# Altium schematic sheet [2] Implausibilities.SchDoc
size A4
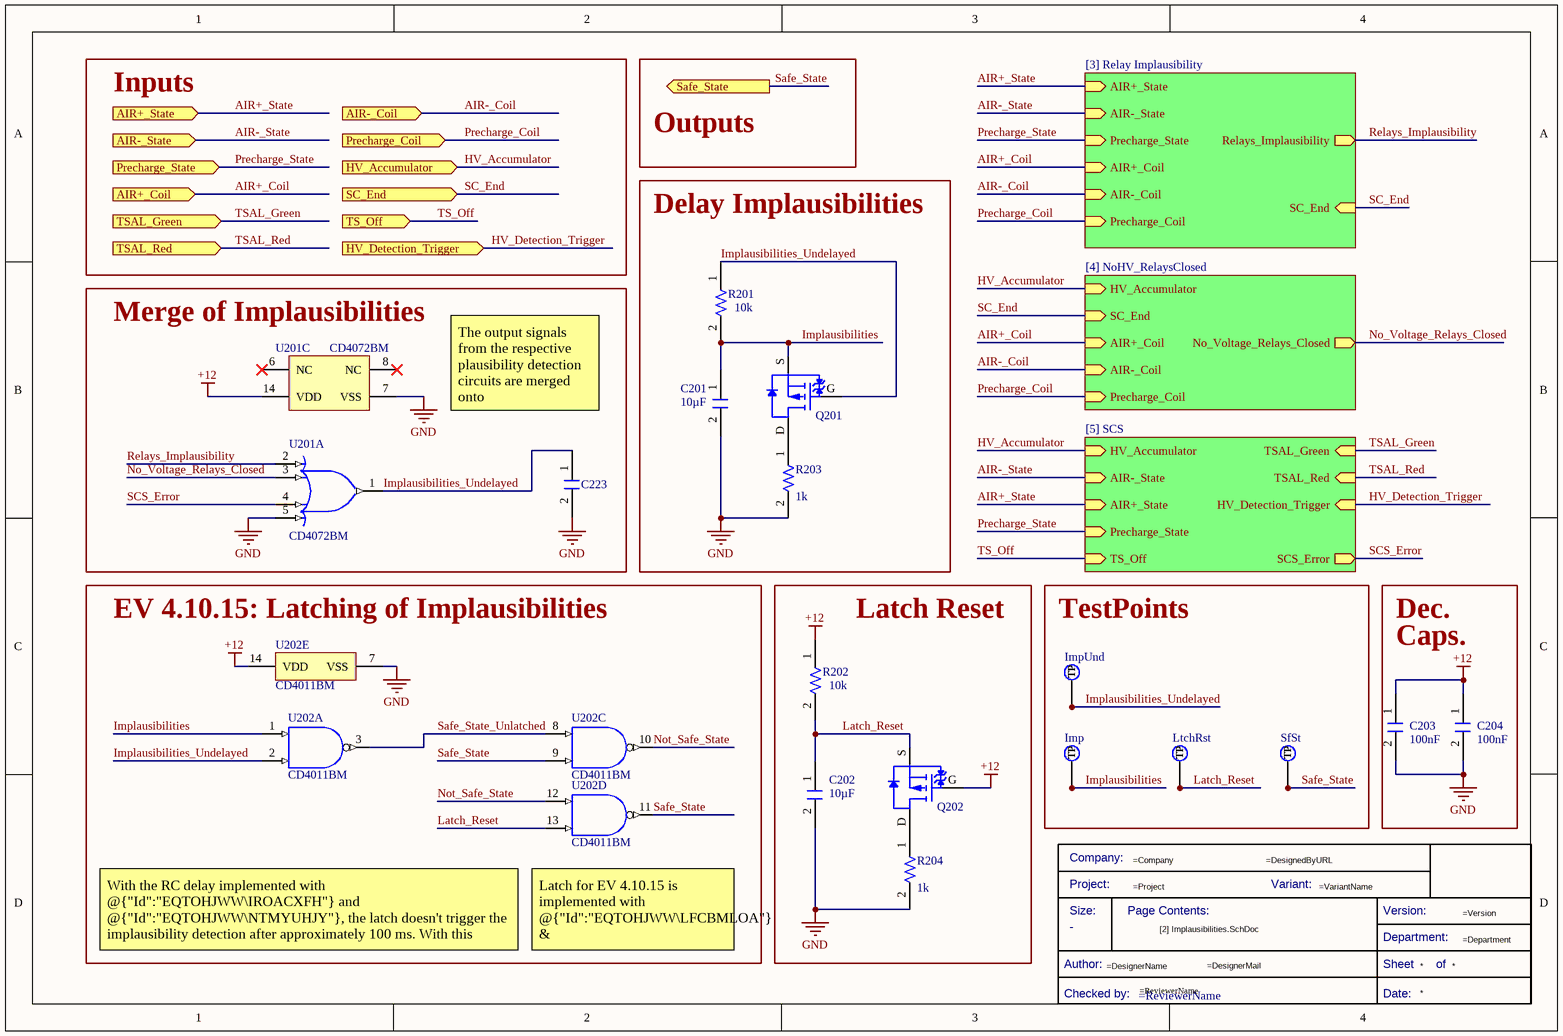
[diagram p0: [2] Implausibilities.SchDoc]

## Parts
*  Title Block_template  (value not drawn)  (graphical)
C201  value 10µF  [C0805FNPC-R]  (hidden comment: C10u-16V-0805FNPC-X5R)
C202  value 10µF  [C0805FNPC-R]  (hidden comment: C10u-16V-0805FNPC-X5R)
C203  value 100nF  [C0805FNPC-R]  (hidden comment: C100n-50V-0805FNPC-X7R)
C204  value 100nF  [C0805FNPC-R]  (hidden comment: C100n-50V-0805FNPC-X7R)
C223  C15p-50V-0805FNPC-NP0  [C0805FNPC-R]  (value not drawn)
Imp  TestPoint  [TestPoint]  (value not drawn)  (no BOM)
ImpUnd  TestPoint  [TestPoint]  (value not drawn)  (no BOM)
LtchRst  TestPoint  [TestPoint]  (value not drawn)  (no BOM)
Q201  TRT-PCH-2/30-BSS  [TRT-PCH-2/30-BSS]  (value not drawn)
Q202  TRT-PCH-2/30-BSS  [TRT-PCH-2/30-BSS]  (value not drawn)
R201  value 10k  [R0805FTK]  (hidden comment: R10k-0805FTK)
R202  value 10k  [R0805FTK]  (hidden comment: R10k-0805FTK)
R203  value 1k  [0805]  (hidden comment: R1K-0805-0.5W)
R204  value 1k  [0805]  (hidden comment: R1K-0805-0.5W)
SfSt  TestPoint  [TestPoint]  (value not drawn)  (no BOM)
U201  CD4072BM  [D0014A_N]  (parts A,C of 3)
U202  CD4011BM  [D0014A_N]  (parts A,C,D,E of 5)

## Blocks framed on the sheet
Delay Implausibilities: C201 Q201 R201 R203
Merge of Implausibilities: C223 U201
EV 4.10.15: Latching of Implausibilities: U202
Latch Reset: C202 Q202 R202 R204
TestPoints: Imp ImpUnd LtchRst SfSt

## Sub-sheets
EV 4.10.14 = [4] NoHV_RelaysClosed: HV_Accumulator (in), SC_End (in), AIR+_Coil (in), AIR-_Coil (in), Precharge_Coil (in), No_Voltage_Relays_Closed (out)
Relay Implausibility = [3] Relay Implausibility: AIR+_State (in), Precharge_State (in), AIR+_Coil (in), AIR-_Coil (in), Precharge_Coil (in), Relays_Implausibility (out), SC_End (in), AIR-_State (in)
SCS = [5] SCS: HV_Accumulator (in), AIR-_State (in), Precharge_State (in), SCS_Error (out), AIR+_State (in), TSAL_Green (in), TSAL_Red (in), TS_Off (in), HV_Detection_Trigger (in)

## Ports
AIR+_Coil (in, see [1] TSAL_Green[1C], [1] TSAL_Green[2A], [3] Relay Implausibility[1A], [4] NoHV_RelaysClosed[1A]), AIR+_State (in, see [1] TSAL_Green[1C], [1] TSAL_Green[2A], [3] Relay Implausibility[1A], [5] SCS[1A]), AIR-_Coil (in, see [1] TSAL_Green[1C], [1] TSAL_Green[2A], [3] Relay Implausibility[1A], [4] NoHV_RelaysClosed[1A]), AIR-_State (in, see [1] TSAL_Green[1C], [1] TSAL_Green[2A], [3] Relay Implausibility[1A], [5] SCS[1A]), HV_Accumulator (in, see [1] TSAL_Green[1C], [1] TSAL_Green[2B], [4] NoHV_RelaysClosed[1A], [5] SCS[1A]), HV_Detection_Trigger (in, see [1] TSAL_Green[1C], [1] TSAL_Green[2B], [5] SCS[1A], [7] TSAL_Red[2A]), Precharge_Coil (in, see [1] TSAL_Green[1C], [1] TSAL_Green[2B], [3] Relay Implausibility[1A], [4] NoHV_RelaysClosed[1A]), Precharge_State (in, see [1] TSAL_Green[1C], [1] TSAL_Green[2A], [3] Relay Implausibility[1A], [5] SCS[1A]), Safe_State (out, see [1] TSAL_Green[2C]), SC_End (in, see [1] TSAL_Green[1C], [1] TSAL_Green[2B], [3] Relay Implausibility[1B], [4] NoHV_RelaysClosed[1A]), TS_Off (in, see [1] TSAL_Green[1D], [1] TSAL_Green[4A], [5] SCS[1A], [6] Green_Driver[1A]), TSAL_Green (in, see [1] TSAL_Green[1D], [1] TSAL_Green[4A], [5] SCS[1A], [6] Green_Driver[2A]), TSAL_Red (in, see [1] TSAL_Green[1D], [1] TSAL_Green[3A], [5] SCS[1B], [7] TSAL_Red[2A], [8] Red_Driver[2A])

## Nets
+12: C203.1 C204.1 Q202.G R202.1 U201.14(VDD) U202.14(VDD)
GND: C201.2 C202.2 C203.2 C204.2 C223.2 R203.2 R204.2 U201.5(D) U201.7(VSS) U202.7(VSS)
AIR+_Coil: port AIR+_Coil, sheet Relay Implausibility/AIR+_Coil, sheet EV 4.10.14/AIR+_Coil
AIR+_State: port AIR+_State, sheet Relay Implausibility/AIR+_State, sheet SCS/AIR+_State
AIR-_Coil: port AIR-_Coil, sheet Relay Implausibility/AIR-_Coil, sheet EV 4.10.14/AIR-_Coil
AIR-_State: port AIR-_State, sheet Relay Implausibility/AIR-_State, sheet SCS/AIR-_State
HV_Accumulator: port HV_Accumulator, sheet SCS/HV_Accumulator, sheet EV 4.10.14/HV_Accumulator
HV_Detection_Trigger: port HV_Detection_Trigger, sheet SCS/HV_Detection_Trigger
Implausibilities: C201.1 Imp.1(TP) Q201.S R201.2 U202.1(A)
Implausibilities_Undelayed: C223.1 ImpUnd.1(TP) Q201.G R201.1 U201.1(J) U202.2(B)
Latch_Reset: C202.1 LtchRst.1(TP) Q202.S R202.2 U202.13(H)
No_Voltage_Relays_Closed: U201.3(B) ; sheet EV 4.10.14/No_Voltage_Relays_Closed
Not_Safe_State: U202.10(L) U202.12(G)
Precharge_Coil: port Precharge_Coil, sheet Relay Implausibility/Precharge_Coil, sheet EV 4.10.14/Precharge_Coil
Precharge_State: port Precharge_State, sheet Relay Implausibility/Precharge_State, sheet SCS/Precharge_State
Relays_Implausibility: U201.2(A) ; sheet Relay Implausibility/Relays_Implausibility
Safe_State: SfSt.1(TP) U202.9(F) U202.11(M) ; port Safe_State
Safe_State_Unlatched: U202.3(J) U202.8(E)
SC_End: port SC_End, sheet Relay Implausibility/SC_End, sheet EV 4.10.14/SC_End
SCS_Error: U201.4(C) ; sheet SCS/SCS_Error
TS_Off: port TS_Off, sheet SCS/TS_Off
TSAL_Green: port TSAL_Green, sheet SCS/TSAL_Green
TSAL_Red: port TSAL_Red, sheet SCS/TSAL_Red
NetQ201_D: Q201.D R203.1
NetQ202_D: Q202.D R204.1

Not connected (* = marked no-connect by the designer): U201 6(NC)* 8(NC)*

## Notes on the sheet
- Inputs
- Outputs
- The output signals from the respective plausibility detection circuits are merged onto @{"Id":"EQTOHJWW\DMHHQXNO"}.
- Dec.
- Caps.
- With the RC delay implemented with @{"Id":"EQTOHJWW\IROACXFH"} and @{"Id":"EQTOHJWW\NTMYUHJY"}, the latch doesn't trigger the implausibility detection after approximately 100 ms. With this system, possible faulty implausibility detections are avoided (e.g. AIRs activation delay).
- (near U202) Latch for EV 4.10.15 is implemented with @{"Id":"EQTOHJWW\LFCBMLOA"} & @{"Id":"EQTOHJWW\TXFEAGDM"}
- (in symbol CMP-00043-8) Company:; Project:; Variant:; Size:; Page Contents:; Version:; Department:; Author:; Sheet; of; Checked by:; Date:

## Library data of the parts
* = CMP-00043-8: Standard Title Block; .SCHcheck: GP; Checked by:: =ReviewerName; Size: -; Design Item ID: Title Block_template; .PCBcheck: GP; .Creator: GP; Source: e-Tech_Racing.SchLib; Category: Title Block
C201 C202 = CMP-00055-8: Multilayer Ceramic Capacitor, Wcap-Csgp Series, 10 F, 20%, X5R, 16 V, 0805 [2012 Metric] Rohs Compliant: Yes; Manufacturer Part Number 1: 885012107014; Manufacturer 1: Wurth Electronics; .Creator: DR; Voltage Rating: 16V; Pricing 1: 50=0,21000, 250=0,20200, 500=0,19100, 1000=0,17400, 2500=0,14700 (GBP); ComponentLink3URL: https://katalog.we-online.de/pbs/datasheet/885012107014.pdf?src-supplier=Digi-Key; Category: Ceramic Capacitors; Thickness: 0.057inch; ComponentLink4URL: http://www.farnell.com/datasheets/1958454.pdf?src-supplier=Newark; Width: 0.049inch; Source: Passives.SchLib; Design Item ID: C10u-16V-0805FNPC-X5R; Packaging: Cut Tape; ComponentLink3Description: https://katalog.we-online.de/pbs/datasheet/885012107014.pdf?src-supplier=Digi-Key; ComponentLink2URL: http://www.farnell.com/datasheets/1958454.pdf?src-supplier=Element14; RoHS: Yes; ComponentLink1Description: http://www.farnell.com/datasheets/1958454.pdf?src-supplier=Farnell; ComponentLink2Description: http://www.farnell.com/datasheets/1958454.pdf?src-supplier=Element14; Min Operating Temperature: -55°C; Case Code (Metric): 2012; Case/Package: 0805; Mount: Surface Mount; Tolerance: 20%; Length: 0.079inch; ComponentLink4Description: http://www.farnell.com/datasheets/1958454.pdf?src-supplier=Newark; ComponentLink1URL: http://www.farnell.com/datasheets/1958454.pdf?src-supplier=Farnell; Dielectric: X5R; RoHS Compliant: Yes; Voltage Rating (DC): 16V; Max Operating Temperature: 85°C; Stock 1: 81550; REACH SVHC: Unknown
C203 C204 = CMP-00063-3: Cap, 0.1ΜF, 50V, 10%, X7R, 0805; Manufacturer Part Number 1: 885012207098; Manufacturer 1: Wurth Electronics; .Creator: DR; ComponentLink2Description: http://www.farnell.com/datasheets/1958498.pdf?src-supplier=Element14; ComponentLink1Description: http://www.farnell.com/datasheets/1958498.pdf?src-supplier=Farnell; Thickness: 0.035inch; ComponentLink1URL: http://www.farnell.com/datasheets/1958498.pdf?src-supplier=Farnell; Min Operating Temperature: -55°C; Packaging: Cut Tape; ComponentLink2URL: http://www.farnell.com/datasheets/1958498.pdf?src-supplier=Element14; Mount: Surface Mount; Voltage Rating (DC): 50V; Tolerance: 10%; Category: Ceramic Capacitors; RoHS: Yes; Width: 0.049inch; Pricing 1: 100=0,10200, 500=0,07100, 2000=0,06100 (GBP); RoHS Compliant: Yes; ComponentLink4Description: http://www.farnell.com/datasheets/1958498.pdf?src-supplier=Newark; Dielectric: X7R; Stock 1: 8000; Length: 0.079inch; ComponentLink3URL: https://katalog.we-online.de/pbs/datasheet/885012207098.pdf?src-supplier=Digi-Key; ComponentLink3Description: https://katalog.we-online.de/pbs/datasheet/885012207098.pdf?src-supplier=Digi-Key; Design Item ID: C100n-50V-0805FNPC-X7R; ComponentLink4URL: http://www.farnell.com/datasheets/1958498.pdf?src-supplier=Newark; REACH SVHC: Unknown; Case Code (Metric): 2012; Voltage Rating: 50V; Max Operating Temperature: 125°C; Source: Passives.SchLib; Case/Package: 0805
C223 = CMP-00056-3: Cap, 15PF, 50V, 5%, C0G/NP0, 0805; Manufacturer Part Number 1: 885012007052; Manufacturer 1: Wurth Electronics; .Creator: DR; Thickness: 0.028inch; RoHS Compliant: Yes; ComponentLink2URL: http://katalog.we-online.de/pbs/datasheet/885012007052.pdf?src-supplier=Digi-Key; Design Item ID: C15p-50V-0805FNPC-NP0; Case Code (Metric): 2012; Max Operating Temperature: 125°C; Mount: Surface Mount; Category: Ceramic Capacitors; Min Operating Temperature: -55°C; Case/Package: 0805; ComponentLink3Description: https://katalog.we-online.de/pbs/datasheet/885012007052.pdf?src-supplier=Digi-Key; ComponentLink1Description: http://www.farnell.com/datasheets/2031702.pdf?src-supplier=Farnell; ComponentLink1URL: http://www.farnell.com/datasheets/2031702.pdf?src-supplier=Farnell; RoHS: Yes; Voltage Rating: 50V; Length: 0.079inch; Source: Passives.SchLib; Value: 15pF; Pricing 1: 1=0,10800, 10=0,05200, 25=0,05100, 50=0,04900, 100=0,04800, 250=0,04600, 500=0,04300 (USD); Tolerance: 5%; ComponentLink3URL: https://katalog.we-online.de/pbs/datasheet/885012007052.pdf?src-supplier=Digi-Key; Stock 1: 815; Packaging: Cut Tape; Width: 0.049inch; ComponentLink2Description: http://katalog.we-online.de/pbs/datasheet/885012007052.pdf?src-supplier=Digi-Key
Imp ImpUnd LtchRst SfSt = CMP-00042-2: Test Point 1x1 mm; .SCHcheck: GP; Category: TestPoint; Source: e-Tech_Racing.SchLib; .Creator: GP; .PCBcheck: GP; Design Item ID: TestPoint
Q201 Q202 = CMP-00144-2: Infineon’s highly innovative OptiMOS™ families include p-channel power MOSFETs, SOT-23-3, RoHS; Manufacturer Part Number: BSS308PEH6327; .Creator: DO; Drain to Source Voltage (Vdss): 30V; Rise Time: 7.7ns; Turn-On Delay Time: 5.6ns; Fall Time: 2.8ns; Input Capacitance: 500pF; Turn-Off Delay Time: 15.3ns; Rds On Max: 80mR; Threshold Voltage: -1.5V; Gate to Source Voltage (Vgs): 20V; Max Power Dissipation: 500mW; Continuous Drain Current (ID): 2A; Stock 1: 4000; ComponentLink1Description: datasheet; Series: OptiMOS™; Source: Semiconductor.SchLib; Number of Pins: 3; ComponentLink2Description: https://datasheet.ciiva.com/11171/infineon-bss308pe-ds-v02-03-en-11171385.pdf?src-supplier=Avnet; REACH SVHC: No SVHC; Mount: Surface Mount; Min Operating Temperature: -55°C; Package Quantity: 1; Design Item ID: TRT-PCH-2/30-BSS; Max Operating Temperature: 150°C; Packaging: Tape and Reel; RoHS: Yes; Category: MOSFETs; Pricing 1: 50=0,50300, 100=0,26400, 250=0,25900, 500=0,25200, 1000=0,24700 (USD); Case/Package: TO-236-3; ComponentLink1URL: https://datasheet.ciiva.com/6379/infineon-bss308pe-ds-v02-03-en-6379920.pdf?src-supplier=Digi-Key; ComponentLink2URL: https://datasheet.ciiva.com/11171/infineon-bss308pe-ds-v02-03-en-11171385.pdf?src-supplier=Avnet; Manufacturer: Infineon
R201 R202 = CMP-00085-4: BOURNS         CR0805-JW-103ELF            Surface Mount Chip Resistor, Thick Film, CR Series, 10 kohm, 125 mW,  5%, 150 V; .Creator: DR; Power Rating: 125mW; Voltage Rating (DC): 100V; Voltage Rating: 150V; Temperature Coefficient: 200ppm/°C; ComponentLink6URL: https://datasheet.ciiva.com/16783/70154685-16783482.pdf?src-supplier=Allied+Electronics; Manufacturer 1: Bourns; Package Quantity: 1; ComponentLink10URL: https://datasheet.ciiva.com/7985/1856384-7985869.pdf?src-supplier=Element14; Technology: THICK FILM; Source: Passives.SchLib; RoHS Compliant: Yes; ComponentLink10Description: https://datasheet.ciiva.com/7985/1856384-7985869.pdf?src-supplier=Element14; ComponentLink1URL: https://datasheet.ciiva.com/11821/0900766b80fcdb72-11821135.pdf?src-supplier=RSComponents; ComponentLink7Description: https://datasheet.ciiva.com/5548/chpreztr-5548491.pdf?src-supplier=Mouser; Radiation Hardening: No; Design Item ID: R10k-0805FTK; ComponentLink4Description: https://datasheet.ciiva.com/7986/691949-7986187.pdf?src-supplier=Element14; Pins: 2; ComponentLink9URL: https://datasheet.ciiva.com/6559/chpreztr-6559901.pdf?src-supplier=Digi-Key; Resistor Type: Thick Film; ComponentLink4URL: https://datasheet.ciiva.com/7986/691949-7986187.pdf?src-supplier=Element14; Contact Plating: Tin; Case Code (Metric): 2012; Military Standard: Not; Depth: 1.25mm; Case/Package: 0805; Packaging: Tape and Reel; ComponentLink9Description: https://datasheet.ciiva.com/6559/chpreztr-6559901.pdf?src-supplier=Digi-Key; Construction: Rectangular; Pricing 1: 1=0,05790, 10=0,01540, 25=0,01340, 100=0,00340 (USD); ComponentLink7URL: https://datasheet.ciiva.com/5548/chpreztr-5548491.pdf?src-supplier=Mouser; Category: Chip SMD Resistors; Length: 2mm; Max Operating Temperature: 155°C; Resistance Tolerance: 5%; Manufacturer Part Number 1: CR0805-JW-103ELF; Height: 0.5mm; ComponentLink2URL: https://datasheet.ciiva.com/9122/chpreztr-9122374.pdf?src-supplier=Avnet; Thickness: 508um; Max Power Dissipation: 125mW; ComponentLink8Description: https://datasheet.ciiva.com/6559/chpreztr-6559900.pdf?src-supplier=Digi-Key; REACH SVHC: No SVHC; ComponentLink8URL: https://datasheet.ciiva.com/6559/chpreztr-6559900.pdf?src-supplier=Digi-Key; ComponentLink5URL: https://datasheet.ciiva.com/30065/159chpreztr-30065976.pdf?src-supplier=Onlinecomponents.com; Width: 1.25mm; ComponentLink11URL: https://datasheet.ciiva.com/48692/001055517-da-01-en-smd-wid-cr0805-jw-103elf-10k-ohm-1-8w-48692118.pdf?src-supplier=Conrad; ComponentLink3Description: https://datasheet.ciiva.com/22693/1902866-22693254.pdf?src-supplier=Element14; ComponentLink11Description: https://datasheet.ciiva.com/48692/001055517-da-01-en-smd-wid-cr0805-jw-103elf-10k-ohm-1-8w-48692118.pdf?src-supplier=Conrad; ComponentLink1Description: https://datasheet.ciiva.com/11821/0900766b80fcdb72-11821135.pdf?src-supplier=RSComponents; ComponentLink2Description: https://datasheet.ciiva.com/9122/chpreztr-9122374.pdf?src-supplier=Avnet; Stock 1: 57566; Min Operating Temperature: -55°C; Series: CR0805; Number of Terminations: 2; Termination: SMD/SMT; Tolerance: 5%; Mount: Surface Mount; ComponentLink6Description: https://datasheet.ciiva.com/16783/70154685-16783482.pdf?src-supplier=Allied+Electronics; ComponentLink5Description: https://datasheet.ciiva.com/30065/159chpreztr-30065976.pdf?src-supplier=Onlinecomponents.com; RoHS: Yes; Features: Moisture Resistant; ComponentLink3URL: https://datasheet.ciiva.com/22693/1902866-22693254.pdf?src-supplier=Element14
R203 R204 = CMP-009-00043-2: Fixed Resistor, Metal Glaze/thick Film, 0.5W, 1000ohm, 150V, 1% +/-Tol, 100ppm/Cel, Surface Mount, 0805; Power: 500mW; Pins: 2; RoHS Compliant: Yes; Tolerance: 1%; Case/Package: 0805; Min Operating Temperature: -55°C; Mounting Technology: Surface Mount; Max Operating Temperature: 155°C
U201 = CMP-00217-1: OR Gate, 4000/14000/40000 Series, 2-Func, 4-Input, CMOS, PDSO14; Package Equivalence Code: SOP14,.25; Package Body Material: Plastic; Power Supplies: 5/15V; Schmitt Trigger: No; Propagation Delay (tpd): 250ns; Nominal Supply Voltage: 5V; Min Supply Voltage: 3V; Channels: 2; Output Characteristics: OPEN-COLLECTOR; Max Supply Voltage: 18V; Load Capacitance (CL): 50pF; Logic Type: OR GATE; Qualification Status: Not Qualified; Number of Inputs: 4; Length: 8.65mm; Technology: CMOS; Surface Mount: Yes; Packaging: Rail/Tube; JESD-609 Code: e4; Terminal Pitch: 1.27mm; Package Shape: Rectangular; Package Style: SMALL OUTLINEMeter; Max Operating Temperature: 125°C; Terminal Position: DUAL; Reach SVHC Compliant: Yes; Terminal Form: Gull Wing; JESD-30 Code: R-PDSO-G14; Width: 3.9mm; Moisture Sensitivity Level: 1; Peak Reflow Temperature (Cel): 260°C; Temperature Grade: MILITARY; Pins: 14; Case/Package: SOP; Terminal Finish: Nickel; Min Operating Temperature: -55°C; Height - Seated (Max): 1.75mm; Prop. Delay@Nom-Sup: 250ns; RoHS Compliant: Yes
U202 = CMP-00211-1: NAND Gate, 4000/14000/40000 Series, 4-Func, 2-Input, CMOS, PDSO14; Package Equivalence Code: SOP14,.25; Package Body Material: Plastic; Load Capacitance (CL): 50pF; Max Supply Voltage: 18V; Min Supply Voltage: 3V; Nominal Supply Voltage: 5V; Propagation Delay (tpd): 250ns; Number of Inputs: 2; Channels: 4; Qualification Status: Not Qualified; Load/Preset Input: Yes; Schmitt Trigger: No; Power Supplies: 5/15V; Height - Seated (Max): 1.75mm; Technology: CMOS; Surface Mount: Yes; Case/Package: SOP; Pins: 14; Terminal Finish: Nickel; RoHS Compliant: Yes; Terminal Pitch: 1.27mm; Length: 8.65mm; Reach SVHC Compliant: Yes; Temperature Grade: MILITARY; Moisture Sensitivity Level: 1; Peak Reflow Temperature (Cel): 260°C; JESD-30 Code: R-PDSO-G14; Package Style: SMALL OUTLINEMeter; Logic Type: NAND GATE; Package Shape: Rectangular; Terminal Form: Gull Wing; Prop. Delay@Nom-Sup: 250ns; JESD-609 Code: e4; Min Operating Temperature: -55°C; Max Operating Temperature: 125°C; Width: 3.9mm; Terminal Position: DUAL; Packaging: Tape and Reel